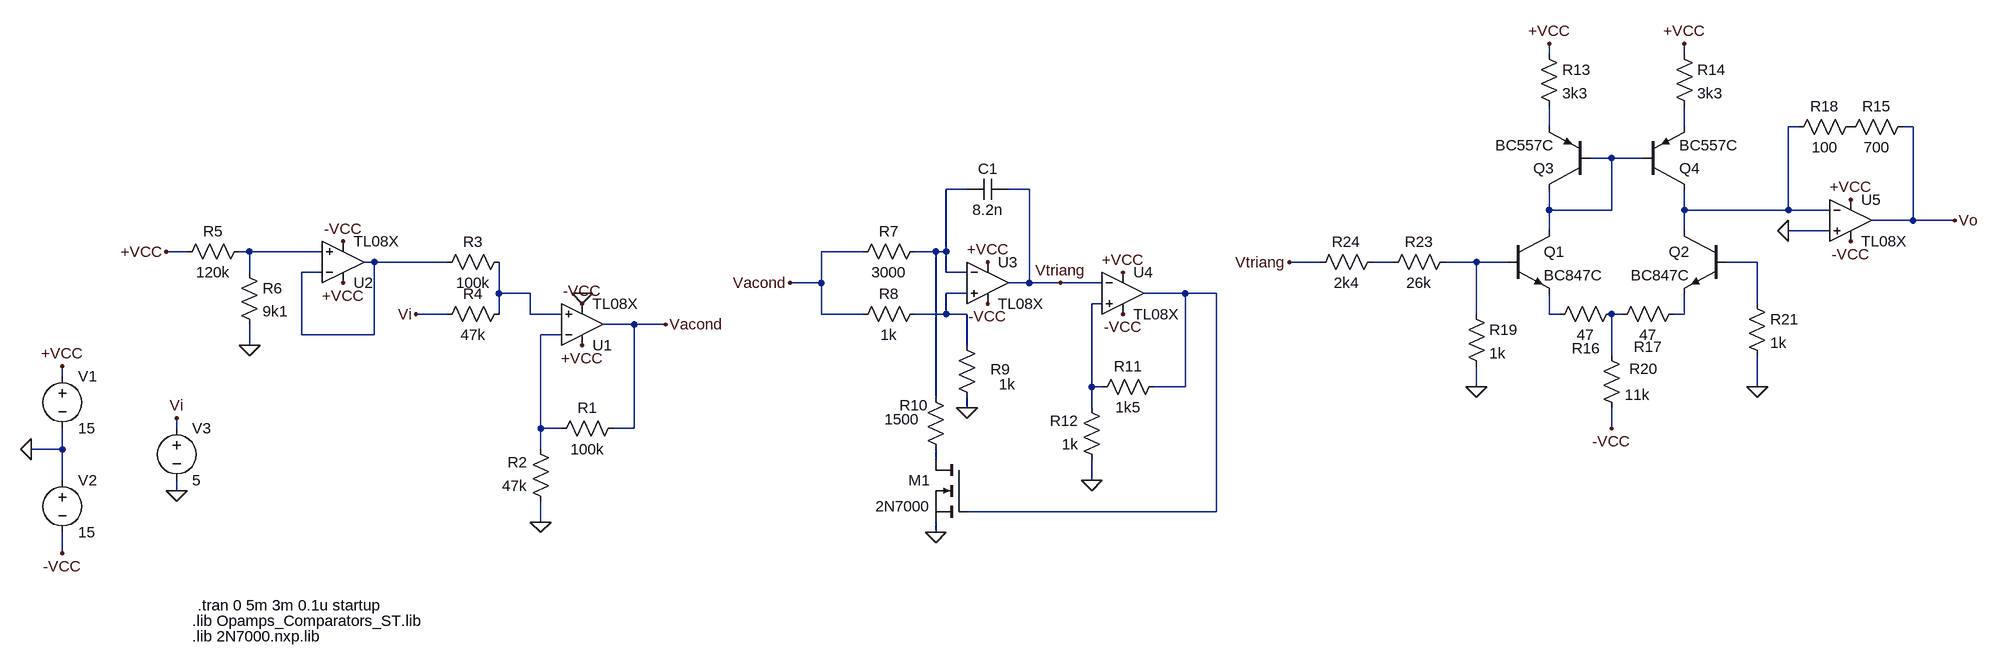
[diagram p0: schematic Completo.asc]
Completo.asc, the LTspice schematic file:
Version 4
SHEET 1 3632 744
WIRE 2368 -320 2368 -336
WIRE 2576 -320 2576 -336
WIRE 2368 -208 2368 -240
WIRE 2576 -208 2576 -240
WIRE 2752 -208 2736 -208
WIRE 2928 -208 2912 -208
WIRE 2464 -160 2432 -160
WIRE 2512 -160 2464 -160
WIRE 1472 -112 1440 -112
WIRE 1568 -112 1536 -112
WIRE 2368 -80 2368 -112
WIRE 2464 -80 2464 -160
WIRE 2464 -80 2368 -80
WIRE 2576 -80 2576 -112
WIRE 2736 -80 2736 -208
WIRE 2736 -80 2576 -80
WIRE 2800 -80 2736 -80
WIRE 2928 -64 2928 -208
WIRE 2928 -64 2864 -64
WIRE 2992 -64 2928 -64
WIRE 2368 -48 2368 -80
WIRE 2576 -48 2576 -80
WIRE 2800 -48 2736 -48
WIRE 272 -16 240 -16
WIRE 368 -16 352 -16
WIRE 480 -16 368 -16
WIRE 1312 -16 1248 -16
WIRE 1424 -16 1392 -16
WIRE 1440 -16 1440 -112
WIRE 1440 -16 1424 -16
WIRE 560 0 544 0
WIRE 672 0 560 0
WIRE 2016 0 1968 0
WIRE 2128 0 2096 0
WIRE 2256 0 2208 0
WIRE 2304 0 2256 0
WIRE 2688 0 2640 0
WIRE 368 16 368 -16
WIRE 480 16 448 16
WIRE 1440 16 1440 -16
WIRE 1472 16 1440 16
WIRE 1248 32 1248 -16
WIRE 1248 32 1200 32
WIRE 1568 32 1568 -112
WIRE 1568 32 1536 32
WIRE 1616 32 1568 32
WIRE 1680 32 1616 32
WIRE 752 48 752 0
WIRE 800 48 752 48
WIRE 1472 48 1440 48
WIRE 1808 48 1744 48
WIRE 1856 48 1808 48
WIRE 1680 64 1664 64
WIRE 2688 64 2688 0
WIRE 672 80 624 80
WIRE 752 80 752 48
WIRE 800 80 800 48
WIRE 848 80 800 80
WIRE 1248 80 1248 32
WIRE 1312 80 1248 80
WIRE 1440 80 1440 48
WIRE 1440 80 1392 80
WIRE 1472 80 1440 80
WIRE 2256 80 2256 0
WIRE 2368 80 2368 48
WIRE 2384 80 2368 80
WIRE 2480 80 2464 80
WIRE 2576 80 2576 48
WIRE 2576 80 2560 80
WIRE 960 96 912 96
WIRE 1008 96 960 96
WIRE 448 112 448 16
WIRE 560 112 560 0
WIRE 560 112 448 112
WIRE 848 112 816 112
WIRE 368 128 368 96
WIRE 1472 128 1472 80
WIRE 2464 144 2464 80
WIRE 80 176 80 160
WIRE 1664 192 1664 64
WIRE 1680 192 1664 192
WIRE 1808 192 1808 48
WIRE 1808 192 1760 192
WIRE 2256 192 2256 160
WIRE 2688 192 2688 144
WIRE 1424 208 1424 -16
WIRE 1472 224 1472 208
WIRE 1664 224 1664 192
WIRE 256 256 256 240
WIRE 816 256 816 112
WIRE 848 256 816 256
WIRE 960 256 960 96
WIRE 960 256 928 256
WIRE 2464 256 2464 224
WIRE 80 288 80 256
WIRE 80 288 32 288
WIRE 816 288 816 256
WIRE 1424 304 1424 288
WIRE 80 336 80 288
WIRE 1664 336 1664 304
WIRE 256 352 256 336
WIRE 1856 384 1856 48
WIRE 1856 384 1472 384
WIRE 816 400 816 368
WIRE 1424 416 1424 400
WIRE 80 448 80 416
FLAG 80 160 +VCC
FLAG 80 448 -VCC
FLAG 256 352 0
FLAG 256 240 Vi
FLAG 880 64 -VCC
FLAG 816 400 0
FLAG 512 -32 -VCC
FLAG 624 80 Vi
FLAG 368 128 0
FLAG 240 -16 +VCC
FLAG 1008 96 Vacond
FLAG 512 32 +VCC
FLAG 880 128 +VCC
FLAG 32 288 0
FLAG 880 48 0
FLAG 1504 64 -VCC
FLAG 1504 0 +VCC
FLAG 1472 224 0
FLAG 1424 416 0
FLAG 1712 80 -VCC
FLAG 1712 16 +VCC
FLAG 1664 336 0
FLAG 1200 32 Vacond
FLAG 1616 32 Vtriang
FLAG 1968 0 Vtriang
FLAG 2576 -336 +VCC
FLAG 2368 -336 +VCC
FLAG 2832 -96 +VCC
FLAG 2832 -32 -VCC
FLAG 2992 -64 Vo
FLAG 2256 192 0
FLAG 2736 -48 0
FLAG 2464 256 -VCC
FLAG 2688 192 0
SYMBOL voltage 80 160 R0
WINDOW 123 0 0 Left 0
WINDOW 39 0 0 Left 0
SYMATTR InstName V1
SYMATTR Value 15
SYMBOL voltage 80 320 R0
WINDOW 123 0 0 Left 0
WINDOW 39 0 0 Left 0
SYMATTR InstName V2
SYMATTR Value 15
SYMBOL voltage 256 240 R0
WINDOW 123 0 0 Left 0
WINDOW 39 0 0 Left 0
SYMATTR InstName V3
SYMATTR Value 5
SYMBOL res 944 240 R90
WINDOW 0 0 56 VBottom 2
WINDOW 3 32 56 VTop 2
SYMATTR InstName R1
SYMATTR Value 100k
SYMBOL res 832 384 R180
WINDOW 0 36 76 Left 2
WINDOW 3 36 40 Left 2
SYMATTR InstName R2
SYMATTR Value 47k
SYMBOL Opamps\\opamp2 880 160 M180
SYMATTR InstName U1
SYMATTR Value TL08X
SYMBOL res 768 -16 R90
WINDOW 0 0 56 VBottom 2
WINDOW 3 32 56 VTop 2
SYMATTR InstName R3
SYMATTR Value 100k
SYMBOL res 768 64 R90
WINDOW 0 0 56 VBottom 2
WINDOW 3 32 56 VTop 2
SYMATTR InstName R4
SYMATTR Value 47k
SYMBOL Opamps\\opamp2 512 64 M180
SYMATTR InstName U2
SYMATTR Value TL08X
SYMBOL res 256 0 R270
WINDOW 0 32 56 VTop 2
WINDOW 3 0 56 VBottom 2
SYMATTR InstName R5
SYMATTR Value 120k
SYMBOL res 352 0 R0
SYMATTR InstName R6
SYMATTR Value 9k1
SYMBOL Opamps\\opamp2 1504 -32 R0
SYMATTR InstName U3
SYMATTR Value TL08X
SYMBOL res 1408 -32 R90
WINDOW 0 0 56 VBottom 2
WINDOW 3 32 56 VTop 2
SYMATTR InstName R7
SYMATTR Value 3000
SYMBOL res 1408 64 R90
WINDOW 0 0 56 VBottom 2
WINDOW 3 32 56 VTop 2
SYMATTR InstName R8
SYMATTR Value 1k
SYMBOL res 1488 224 R180
WINDOW 0 -51 59 Left 2
WINDOW 3 -59 36 Left 2
SYMATTR InstName R9
SYMATTR Value 1k
SYMBOL nmos 1472 304 M0
SYMATTR InstName M1
SYMATTR Value 2N7000
SYMATTR Prefix X
SYMBOL res 1408 192 R0
WINDOW 0 -40 28 Left 2
WINDOW 3 -63 50 Left 2
SYMATTR InstName R10
SYMATTR Value 1500
SYMBOL cap 1536 -128 R90
WINDOW 0 0 32 VBottom 2
WINDOW 3 32 32 VTop 2
SYMATTR InstName C1
SYMATTR Value 8.2n
SYMBOL Opamps\\opamp2 1712 -16 R0
SYMATTR InstName U4
SYMATTR Value TL08X
SYMBOL res 1776 176 R90
WINDOW 0 0 56 VBottom 2
WINDOW 3 32 56 VTop 2
SYMATTR InstName R11
SYMATTR Value 1k5
SYMBOL res 1680 320 R180
WINDOW 0 36 76 Left 2
WINDOW 3 36 40 Left 2
SYMATTR InstName R12
SYMATTR Value 1k
SYMBOL res 2224 -16 R90
WINDOW 0 0 56 VBottom 2
WINDOW 3 32 56 VTop 2
SYMATTR InstName R23
SYMATTR Value 26k
SYMBOL res 2112 -16 R90
WINDOW 0 0 56 VBottom 2
WINDOW 3 32 56 VTop 2
SYMATTR InstName R24
SYMATTR Value 2k4
SYMBOL npn 2304 -48 R0
SYMATTR InstName Q1
SYMATTR Value BC847C
SYMBOL npn 2640 -48 M0
SYMATTR InstName Q2
SYMATTR Value BC847C
SYMBOL res 2352 -336 R0
SYMATTR InstName R13
SYMATTR Value 3k3
SYMBOL res 2560 -336 R0
SYMATTR InstName R14
SYMATTR Value 3k3
SYMBOL Opamps\\opamp2 2832 -128 R0
SYMATTR InstName U5
SYMATTR Value TL08X
SYMBOL res 2928 -224 R90
WINDOW 0 0 56 VBottom 2
WINDOW 3 32 56 VTop 2
SYMATTR InstName R15
SYMATTR Value 700
SYMBOL res 2480 64 R90
WINDOW 0 84 55 VBottom 2
WINDOW 3 32 56 VTop 2
SYMATTR InstName R16
SYMATTR Value 47
SYMBOL res 2576 64 R90
WINDOW 0 82 56 VBottom 2
WINDOW 3 32 56 VTop 2
SYMATTR InstName R17
SYMATTR Value 47
SYMBOL res 2848 -224 R90
WINDOW 0 0 56 VBottom 2
WINDOW 3 32 56 VTop 2
SYMATTR InstName R18
SYMATTR Value 100
SYMBOL res 2240 64 R0
SYMATTR InstName R19
SYMATTR Value 1k
SYMBOL pnp 2432 -112 R180
SYMATTR InstName Q3
SYMATTR Value BC557C
SYMBOL pnp 2512 -112 M180
SYMATTR InstName Q4
SYMATTR Value BC557C
SYMBOL res 2448 128 R0
WINDOW 0 43 36 Left 2
SYMATTR InstName R20
SYMATTR Value 11k
SYMBOL res 2672 48 R0
SYMATTR InstName R21
SYMATTR Value 1k
TEXT 288 528 Left 2 !.tran 0 5m 3m 0.1u startup
TEXT 280 552 Left 2 !.lib Opamps_Comparators_ST.lib
TEXT 280 576 Left 2 !.lib 2N7000.nxp.lib

The netlist it stands for:
* Completo.asc
V1 +VCC 0 15
V2 0 -VCC 15
V3 Vi 0 5
R1 Vacond N018 100k
R2 0 N018 47k
XU1 N011 N018 +VCC -VCC Vacond TL08X  ; pins In+ In- V+ V- OUT
R3 N011 N007 100k
R4 N011 Vi 47k
XU2 N006 N007 +VCC -VCC N007 TL08X  ; pins In+ In- V+ V- OUT
R5 +VCC N006 120k
R6 N006 0 9k1
XU3 N012 N005 +VCC -VCC Vtriang TL08X  ; pins In+ In- V+ V- OUT
R7 N005 Vacond 3000
R8 N012 Vacond 1k
R9 0 N012 1k
XM1 N019 N013 0 2N7000  ; pins D G S
R10 N005 N019 1500
C1 Vtriang N005 8.2n
XU4 N014 Vtriang +VCC -VCC N013 TL08X  ; pins In+ In- V+ V- OUT
R11 N013 N014 1k5
R12 0 N014 1k
R23 N009 N008 26k
R24 N008 Vtriang 2k4
Q1 N004 N009 N015 0 BC847C
Q2 N003 N010 N017 0 BC847C
R13 +VCC N001 3k3
R14 +VCC N002 3k3
XU5 0 N003 +VCC -VCC Vo TL08X  ; pins In+ In- V+ V- OUT
R15 Vo P001 700
R16 N016 N015 47
R17 N017 N016 47
R18 P001 N003 100
R19 N009 0 1k
Q3 N004 N004 N001 0 BC557C
Q4 N003 N004 N002 0 BC557C
R20 N016 -VCC 11k
R21 N010 0 1k
.model NPN NPN
.model PNP PNP
.lib standard.bjt
.tran 0 5m 3m 0.1u startup
.lib Opamps_Comparators_ST.lib
.lib 2N7000.nxp.lib
.backanno
.end